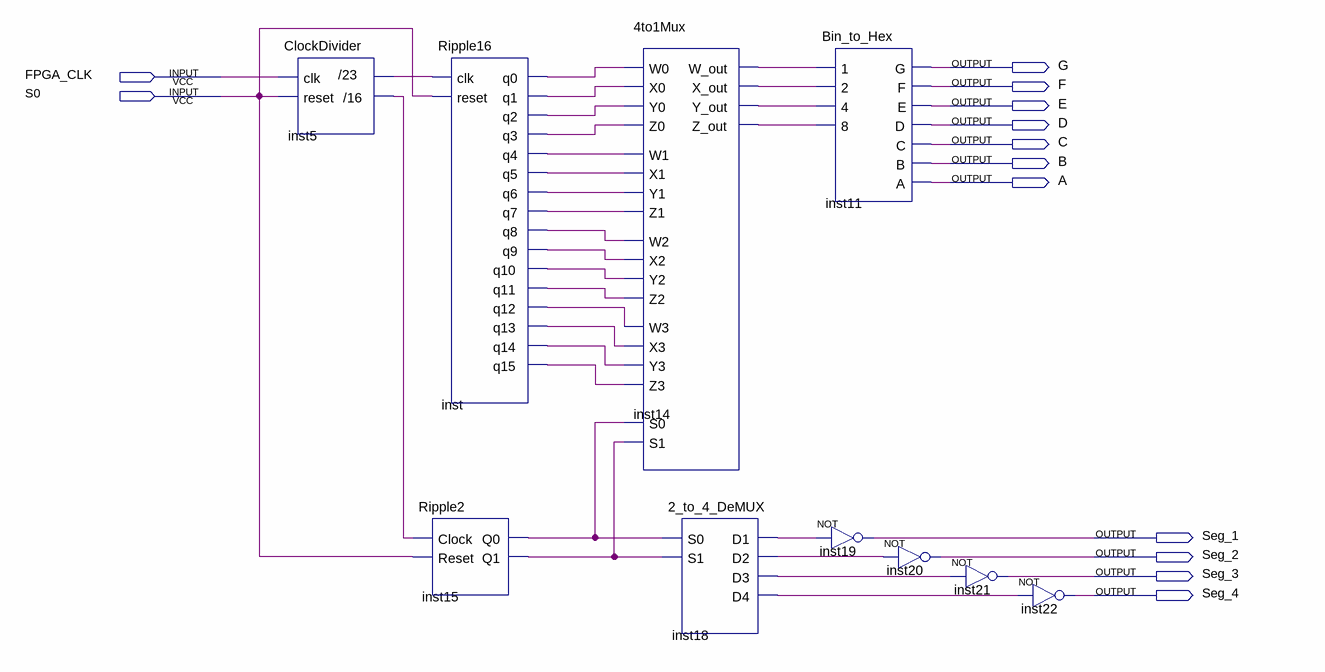
[diagram p0: schematic sheet]
// Quartus schematic Lab3b.bdf as structural Verilog: 10 symbols, 13 pins
module Lab3b (
  input  FPGA_CLK,
  input  S0,
  output G,
  output F,
  output E,
  output D,
  output C,
  output B,
  output A,
  output Seg_1,
  output Seg_2,
  output Seg_3,
  output Seg_4
);

  wire inst5__16, inst5__23, inst14_w_out, inst14_x_out, inst14_y_out, inst14_z_out, inst15_q0, inst15_q1,
       inst18_d1, inst18_d2, inst18_d3, inst18_d4, inst_q0, inst_q1, inst_q2, inst_q3, inst_q4, inst_q5,
       inst_q6, inst_q7, inst_q8, inst_q9, inst_q10, inst_q11, inst_q12, inst_q13, inst_q14, inst_q15;

  ClockDivider inst5 (.clk(FPGA_CLK), .reset(S0), .\/16 (inst5__16), .\/23 (inst5__23));
  Ripple16 inst (
    .clk(inst5__23), .reset(S0), .q0(inst_q0), .q1(inst_q1), .q2(inst_q2), .q3(inst_q3), .q4(inst_q4),
    .q5(inst_q5), .q6(inst_q6), .q7(inst_q7), .q8(inst_q8), .q9(inst_q9), .q10(inst_q10), .q11(inst_q11),
    .q12(inst_q12), .q13(inst_q13), .q14(inst_q14), .q15(inst_q15));
  Ripple2 inst15 (.Clock(inst5__16), .Reset(S0), .Q0(inst15_q0), .Q1(inst15_q1));
  \4to1Mux  inst14 (
    .W0(inst_q0), .X0(inst_q1), .Y0(inst_q2), .Z0(inst_q3), .W1(inst_q4), .X1(inst_q5), .Y1(inst_q6),
    .Z1(inst_q7), .W2(inst_q8), .X2(inst_q9), .Y2(inst_q10), .Z2(inst_q11), .W3(inst_q12), .X3(inst_q13),
    .Y3(inst_q14), .Z3(inst_q15), .S0(inst15_q0), .S1(inst15_q1), .W_out(inst14_w_out), .X_out(inst14_x_out),
    .Y_out(inst14_y_out), .Z_out(inst14_z_out));
  \2_to_4_DeMUX  inst18 (
    .S0(inst15_q0), .S1(inst15_q1), .D1(inst18_d1), .D2(inst18_d2), .D3(inst18_d3), .D4(inst18_d4));
  Bin_to_Hex inst11 (
    .\8 (inst14_z_out), .\4 (inst14_y_out), .\2 (inst14_x_out), .\1 (inst14_w_out), .G(G), .F(F), .E(E),
    .D(D), .C(C), .B(B), .A(A));
  not inst19 (Seg_1, inst18_d1);
  not inst20 (Seg_2, inst18_d2);
  not inst21 (Seg_3, inst18_d3);
  not inst22 (Seg_4, inst18_d4);
endmodule
